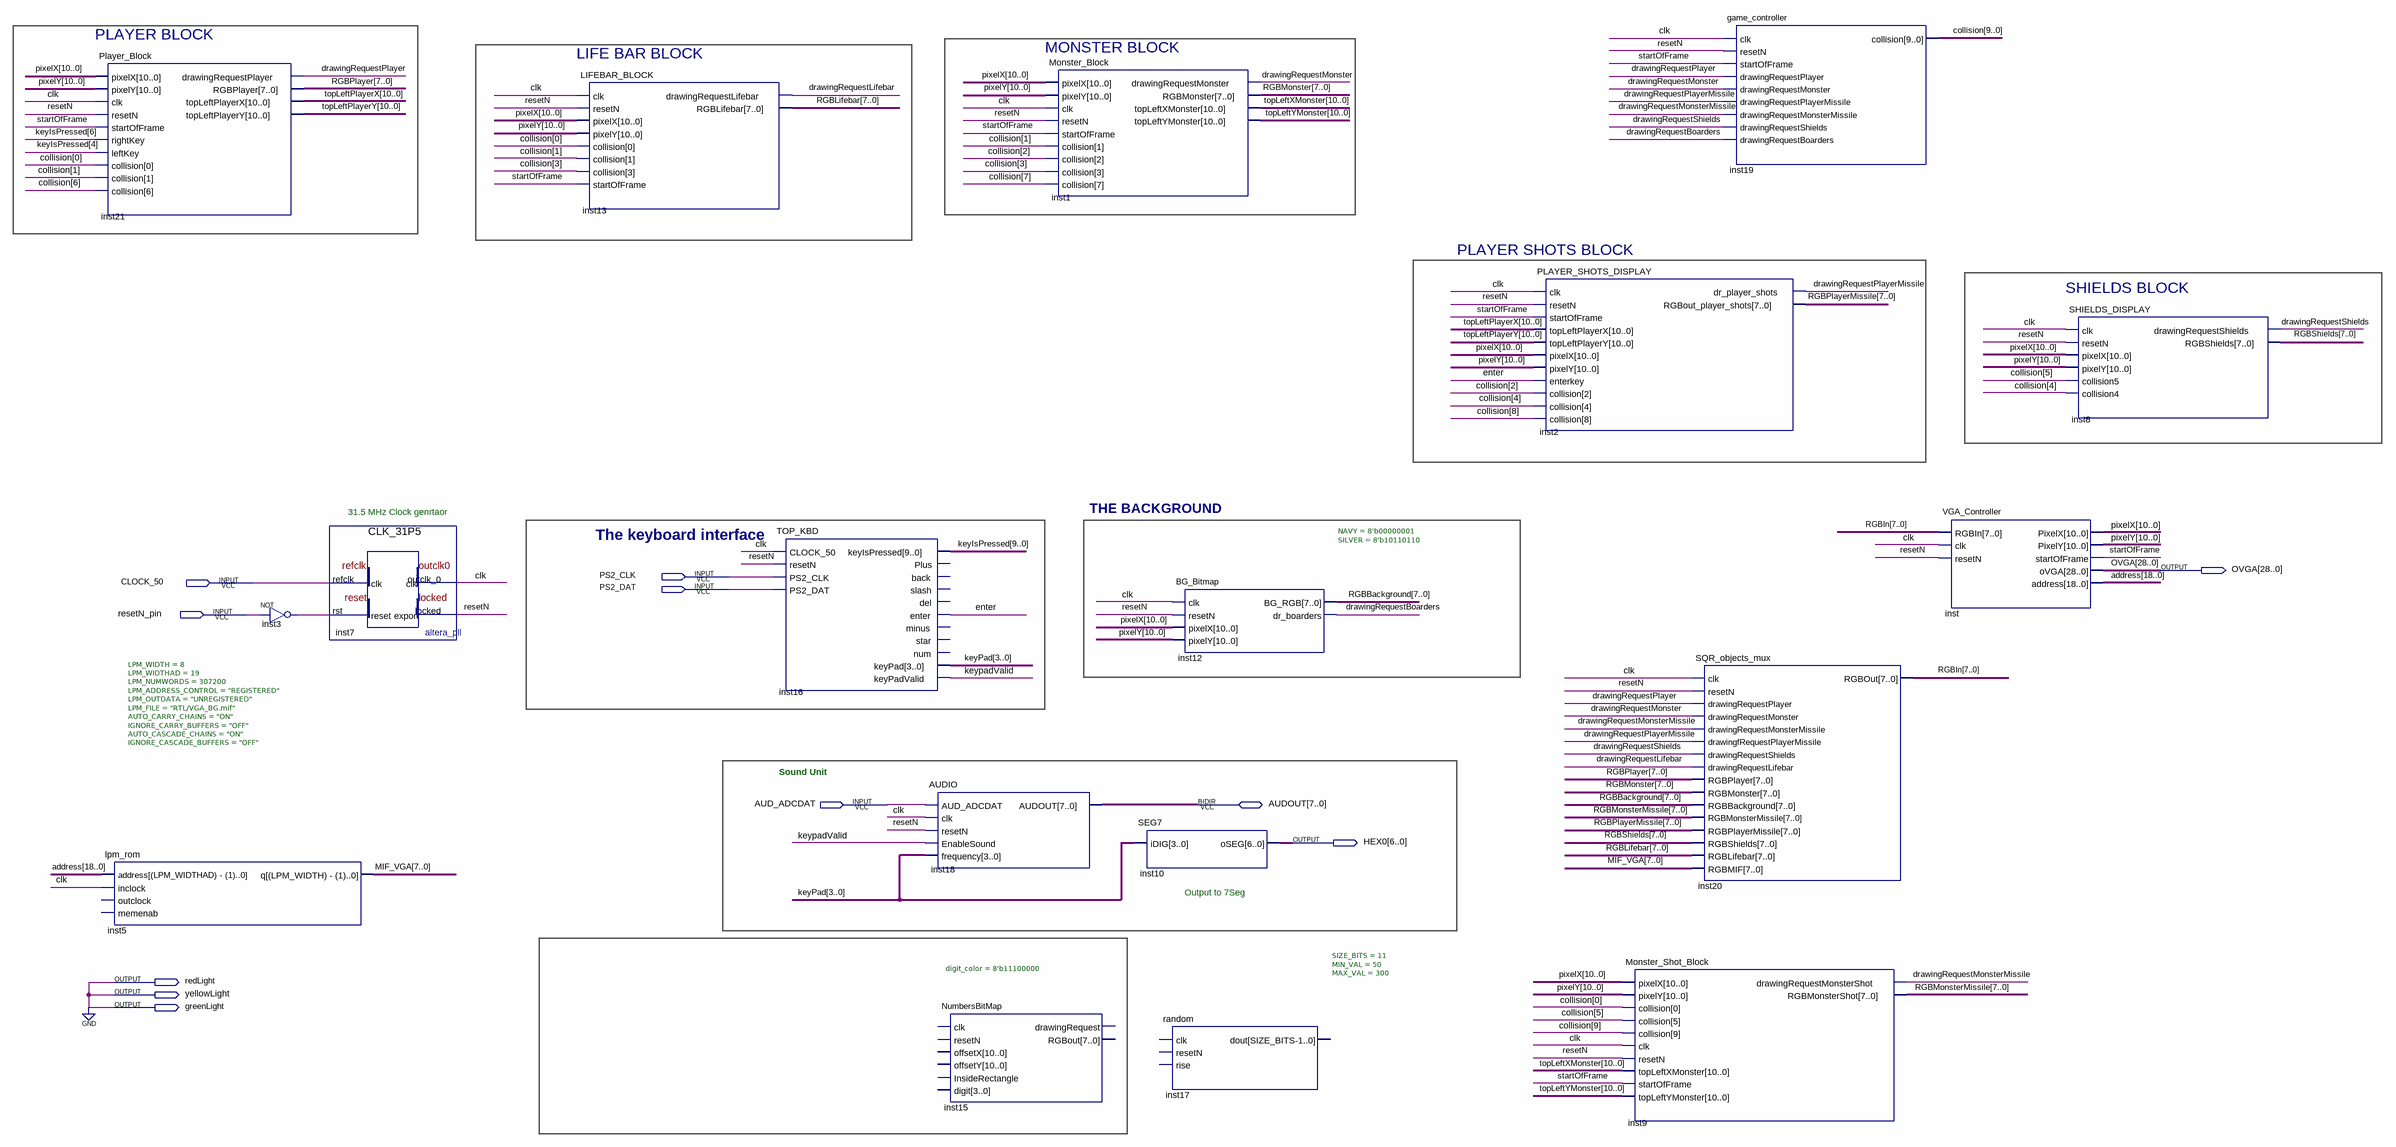
[diagram p0: schematic sheet]
// Quartus schematic TOP_VGA_DEMO_KBD.bdf as structural Verilog: 18 symbols, 11 pins
module TOP_VGA_DEMO_KBD (
  input  PS2_CLK,
  input  CLOCK_50,
  input  PS2_DAT,
  input  resetN_pin,
  input  AUD_ADCDAT,
  inout  [7:0] AUDOUT,
  output [28:0] OVGA,
  output [6:0] HEX0,
  output redLight,
  output yellowLight,
  output greenLight
);

  wire clk, drawingRequestBoarders, drawingRequestLifebar, drawingRequestMonster,
       drawingRequestMonsterMissile, drawingRequestPlayer, drawingRequestPlayerMissile,
       drawingRequestShields, enter, inst3_out, keypadValid, resetN, startOfFrame;
  wire [3:0] keyPad;
  wire [7:0] MIF_VGA, RGBBackground, RGBIn, RGBLifebar, RGBMonster, RGBMonsterMissile, RGBPlayer,
       RGBPlayerMissile, RGBShields;
  wire [9:0] collision, keyIsPressed;
  wire [10:0] pixelX, pixelY, topLeftPlayerX, topLeftPlayerY, topLeftXMonster, topLeftYMonster;
  wire [18:0] address;

  Player_Block inst21 (
    .pixelX(pixelX), .pixelY(pixelY), .clk(clk), .resetN(resetN), .startOfFrame(startOfFrame),
    .rightKey(keyIsPressed[6]), .leftKey(keyIsPressed[4]), .collision({collision[6], collision[1:0]}),
    .drawingRequestPlayer(drawingRequestPlayer), .RGBPlayer(RGBPlayer), .topLeftPlayerX(topLeftPlayerX),
    .topLeftPlayerY(topLeftPlayerY));
  lpm_rom #(.LPM_WIDTH(8), .LPM_WIDTHAD(19), .LPM_NUMWORDS(307200), .LPM_ADDRESS_CONTROL("REGISTERED"), .LPM_OUTDATA("UNREGISTERED"), .LPM_FILE("RTL/VGA_BG.mif"), .AUTO_CARRY_CHAINS("ON"), .IGNORE_CARRY_BUFFERS("OFF"), .AUTO_CASCADE_CHAINS("ON"), .IGNORE_CASCADE_BUFFERS("OFF")) inst5 (
    .address(address), .inclock(clk), .q(MIF_VGA));  // open: outclock, memenab
  not inst3 (inst3_out, resetN_pin);
  CLK_31P5 inst7 (.refclk(CLOCK_50), .rst(inst3_out), .outclk_0(clk), .locked(resetN));
  LIFEBAR_BLOCK inst13 (
    .clk(clk), .resetN(resetN), .pixelX(pixelX), .pixelY(pixelY), .collision({collision[3], collision[1:0]}),
    .startOfFrame(startOfFrame), .drawingRequestLifebar(drawingRequestLifebar), .RGBLifebar(RGBLifebar));
  TOP_KBD inst16 (
    .CLOCK_50(clk), .resetN(resetN), .PS2_CLK(PS2_CLK), .PS2_DAT(PS2_DAT), .keyIsPressed(keyIsPressed),
    .enter(enter), .keyPad(keyPad), .keyPadValid(keypadValid));  // open: Plus, back, slash, del, minus, star, num
  AUDIO inst18 (
    .AUD_ADCDAT(AUD_ADCDAT), .clk(clk), .resetN(resetN), .EnableSound(keypadValid), .frequency(keyPad),
    .AUDOUT(AUDOUT));
  NumbersBitMap #(.digit_color(8'b11100000)) inst15 ();  // open: clk, resetN, offsetX, offsetY, InsideRectangle, digit, drawingRequest, RGBout
  Monster_Block inst1 (
    .pixelX(pixelX), .pixelY(pixelY), .clk(clk), .resetN(resetN), .startOfFrame(startOfFrame),
    .collision({collision[7], collision[3:1]}), .drawingRequestMonster(drawingRequestMonster),
    .RGBMonster(RGBMonster), .topLeftXMonster(topLeftXMonster), .topLeftYMonster(topLeftYMonster));
  BG_Bitmap #(.NAVY(8'b00000001), .SILVER(8'b10110110)) inst12 (
    .clk(clk), .resetN(resetN), .pixelX(pixelX), .pixelY(pixelY), .BG_RGB(RGBBackground),
    .dr_boarders(drawingRequestBoarders));
  SEG7 inst10 (.iDIG(keyPad), .oSEG(HEX0));
  random #(.SIZE_BITS(11), .MIN_VAL(50), .MAX_VAL(300)) inst17 ();  // open: clk, resetN, rise, dout
  PLAYER_SHOTS_DISPLAY inst2 (
    .clk(clk), .resetN(resetN), .startOfFrame(startOfFrame), .topLeftPlayerX(topLeftPlayerX),
    .topLeftPlayerY(topLeftPlayerY), .pixelX(pixelX), .pixelY(pixelY), .enterkey(enter),
    .collision({collision[8], collision[4], collision[2]}), .dr_player_shots(drawingRequestPlayerMissile),
    .RGBout_player_shots(RGBPlayerMissile));
  Monster_Shot_Block inst9 (
    .pixelX(pixelX), .pixelY(pixelY), .collision({collision[9], collision[5], collision[0]}), .clk(clk),
    .resetN(resetN), .topLeftXMonster(topLeftXMonster), .startOfFrame(startOfFrame),
    .topLeftYMonster(topLeftYMonster), .drawingRequestMonsterShot(drawingRequestMonsterMissile),
    .RGBMonsterShot(RGBMonsterMissile));
  game_controller inst19 (
    .clk(clk), .resetN(resetN), .startOfFrame(startOfFrame), .drawingRequestPlayer(drawingRequestPlayer),
    .drawingRequestMonster(drawingRequestMonster), .drawingRequestPlayerMissile(drawingRequestPlayerMissile),
    .drawingRequestMonsterMissile(drawingRequestMonsterMissile),
    .drawingRequestShields(drawingRequestShields), .drawingRequestBoarders(drawingRequestBoarders),
    .collision(collision));
  SQR_objects_mux inst20 (
    .clk(clk), .resetN(resetN), .drawingRequestPlayer(drawingRequestPlayer),
    .drawingRequestMonster(drawingRequestMonster),
    .drawingRequestMonsterMissile(drawingRequestMonsterMissile),
    .drawingfRequestPlayerMissile(drawingRequestPlayerMissile),
    .drawingRequestShields(drawingRequestShields), .drawingRequestLifebar(drawingRequestLifebar),
    .RGBPlayer(RGBPlayer), .RGBMonster(RGBMonster), .RGBBackground(RGBBackground),
    .RGBMonsterMissile(RGBMonsterMissile), .RGBPlayerMissile(RGBPlayerMissile), .RGBShields(RGBShields),
    .RGBLifebar(RGBLifebar), .RGBMIF(MIF_VGA), .RGBOut(RGBIn));
  VGA_Controller inst (
    .RGBIn(RGBIn), .clk(clk), .resetN(resetN), .PixelX(pixelX), .PixelY(pixelY), .startOfFrame(startOfFrame),
    .oVGA(OVGA), .address(address));
  SHIELDS_DISPLAY inst8 (
    .clk(clk), .resetN(resetN), .pixelX(pixelX), .pixelY(pixelY), .collision5(collision[5]),
    .collision4(collision[4]), .drawingRequestShields(drawingRequestShields), .RGBShields(RGBShields));

  assign greenLight = 1'b0;
  assign redLight = 1'b0;
  assign yellowLight = 1'b0;

  // Notes on the sheet:
  //   PLAYER BLOCK
  //   MONSTER BLOCK
  //   LIFE BAR BLOCK
  //   PLAYER SHOTS BLOCK
  //   SHIELDS BLOCK
  //   THE BACKGROUND
  //   31.5 MHz Clock genrtaor
  //   The keyboard interface
  //   Sound Unit
  //   Output to 7Seg
endmodule
